# Altium schematic sheet Baxandall.SchDoc
size A4; SheetNumber: 3; SheetTotal: 4
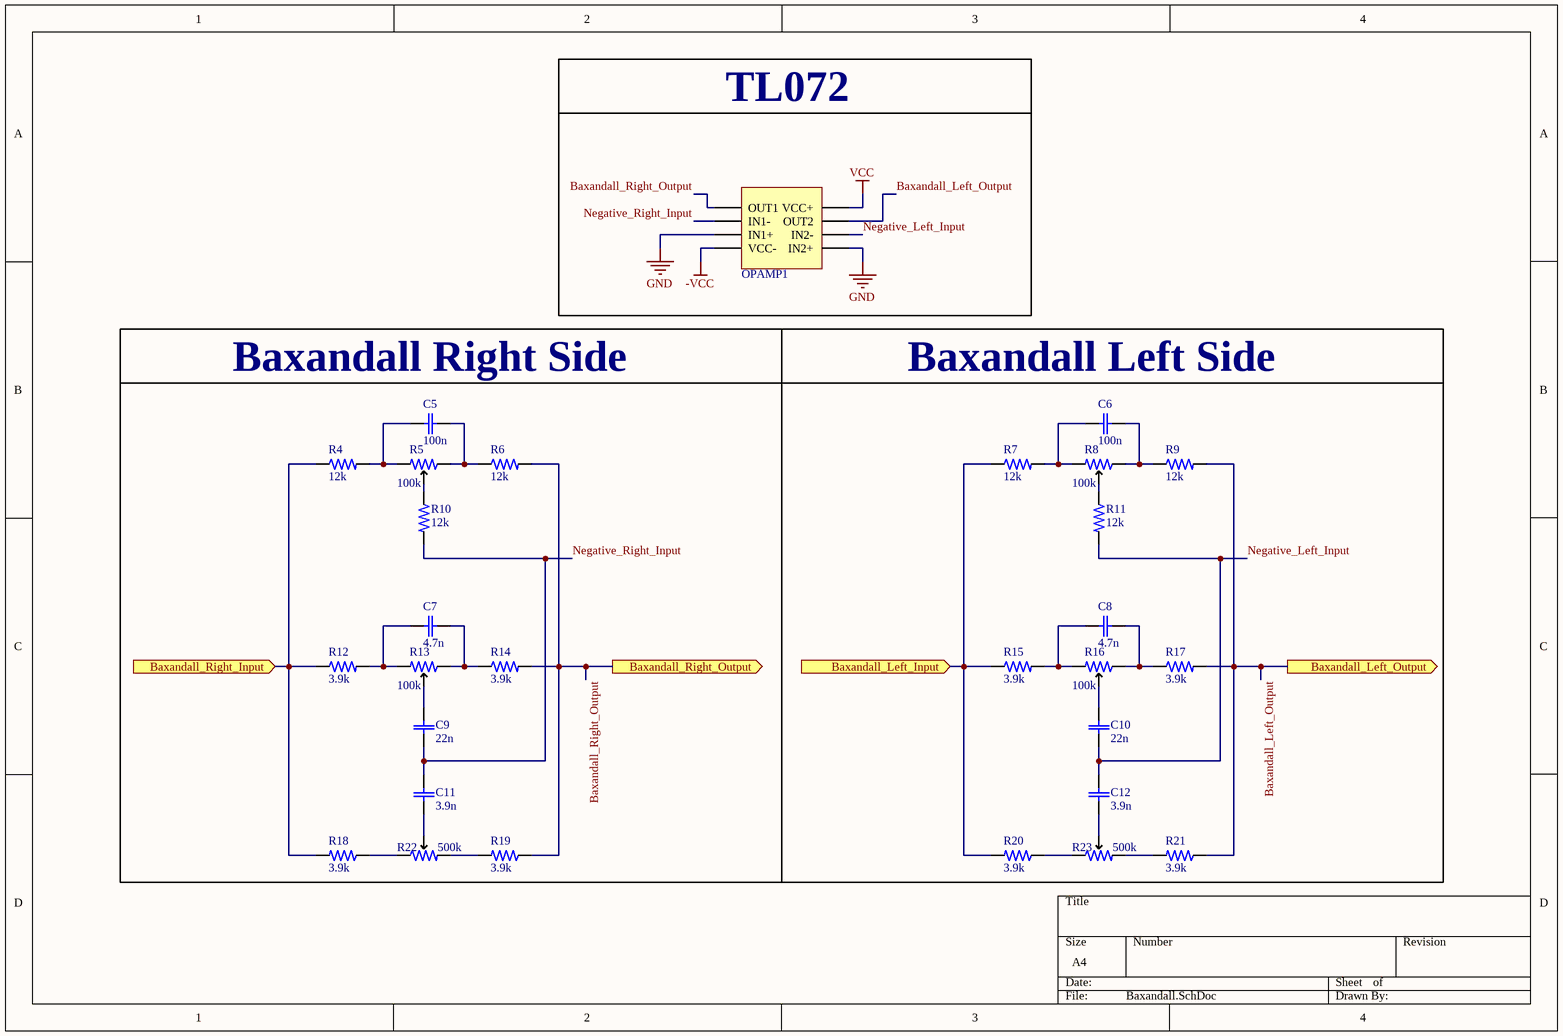
[diagram p0: Baxandall.SchDoc]

## Parts
C5  100n  [CERAMIC0603]
C6  100n  [CERAMIC0603]
C7  4.7n  [CERAMIC0603]
C8  4.7n  [CERAMIC0603]
C9  22n  [CERAMIC0603]
C10  22n  [CERAMIC0603]
C11  3.9n  [CERAMIC0603]
C12  3.9n  [CERAMIC0603]
OPAMP1  TL072  [DIP8]  (value not drawn)
R4  12k  [RES0603]
R5  100k  [Potentiometer THT]
R6  12k  [RES0603]
R7  12k  [RES0603]
R8  100k  [Potentiometer THT]
R9  12k  [RES0603]
R10  12k  [RES0603]
R11  12k  [RES0603]
R12  3.9k  [RES0603]
R13  100k  [Potentiometer THT]
R14  3.9k  [RES0603]
R15  3.9k  [RES0603]
R16  100k  [Potentiometer THT]
R17  3.9k  [RES0603]
R18  3.9k  [RES0603]
R19  3.9k  [RES0603]
R20  3.9k  [RES0603]
R21  3.9k  [RES0603]
R22  500k  [Potentiometer THT]
R23  500k  [Potentiometer THT]

## Ports
Baxandall_Left_Input (in, see Schematic[2B]), Baxandall_Left_Output (out, see Schematic[3B]), Baxandall_Right_Input (in, see Schematic[2B]), Baxandall_Right_Output (out, see Schematic[3B])

## Nets
-VCC: OPAMP1.4(VCC-)
GND: OPAMP1.3(IN1+) OPAMP1.5(IN2+)
VCC: OPAMP1.8(VCC+)
Baxandall_Left_Input: R7.1 R15.1 R20.2 ; port Baxandall_Left_Input
Baxandall_Left_Output: OPAMP1.7(OUT2) R9.2 R17.2 R21.1 ; port Baxandall_Left_Output
Baxandall_Right_Input: R4.1 R12.1 R18.2 ; port Baxandall_Right_Input
Baxandall_Right_Output: OPAMP1.1(OUT1) R6.2 R14.2 R19.1 ; port Baxandall_Right_Output
Negative_Left_Input: C10.1(C1) C12.1(C1) OPAMP1.6(IN2-) R11.2
Negative_Right_Input: C9.1(C1) C11.1(C1) OPAMP1.2(IN1-) R10.2
NetC5_1: C5.1(C1) R4.2 R5.2
NetC5_2: C5.2(C2) R5.1 R6.1
NetC6_1: C6.1(C1) R7.2 R8.2
NetC6_2: C6.2(C2) R8.1 R9.1
NetC7_1: C7.1(C1) R12.2 R13.2
NetC7_2: C7.2(C2) R13.1 R14.1
NetC8_1: C8.1(C1) R15.2 R16.2
NetC8_2: C8.2(C2) R16.1 R17.1
NetC9_2: C9.2(C2) R13.3
NetC10_2: C10.2(C2) R16.3
NetC11_2: C11.2(C2) R22.3
NetC12_2: C12.2(C2) R23.3
NetR5_3: R5.3 R10.1
NetR8_3: R8.3 R11.1
NetR18_1: R18.1 R22.1
NetR19_2: R19.2 R22.2
NetR20_1: R20.1 R23.1
NetR21_2: R21.2 R23.2

## Notes on the sheet
- TL072
- (near C5) Baxandall Right Side
- (near C6) Baxandall Left Side

## Library data of the parts
C5-C12 = Cap: MF: KEMET; MP: TAJC226M025RNJ; SnapEDA_Link: https://www.snapeda.com/parts/TAJC226M025RNJ/KEMET/view-part/?ref=snap; Availability: In Stock; Price: None; Purchase-URL: https://pricing.snapeda.com/search/part/TAJC226M025RNJ/?ref=eda; Package: None; Check_prices: https://www.snapeda.com/parts/TAJC226M025RNJ/KEMET/view-part/?ref=eda; Value: *
R4 R6 R7 R9-R12 R14 R15 R17-R21 = RESISTOR SMD: MP: 3-1879460-6; Package: None; Price: None; Value: *; Availability: Unavailable
R5 R8 R13 R16 R22 R23 = Potentiometer